# Altium schematic sheet Receiver.SchDoc
size Letter
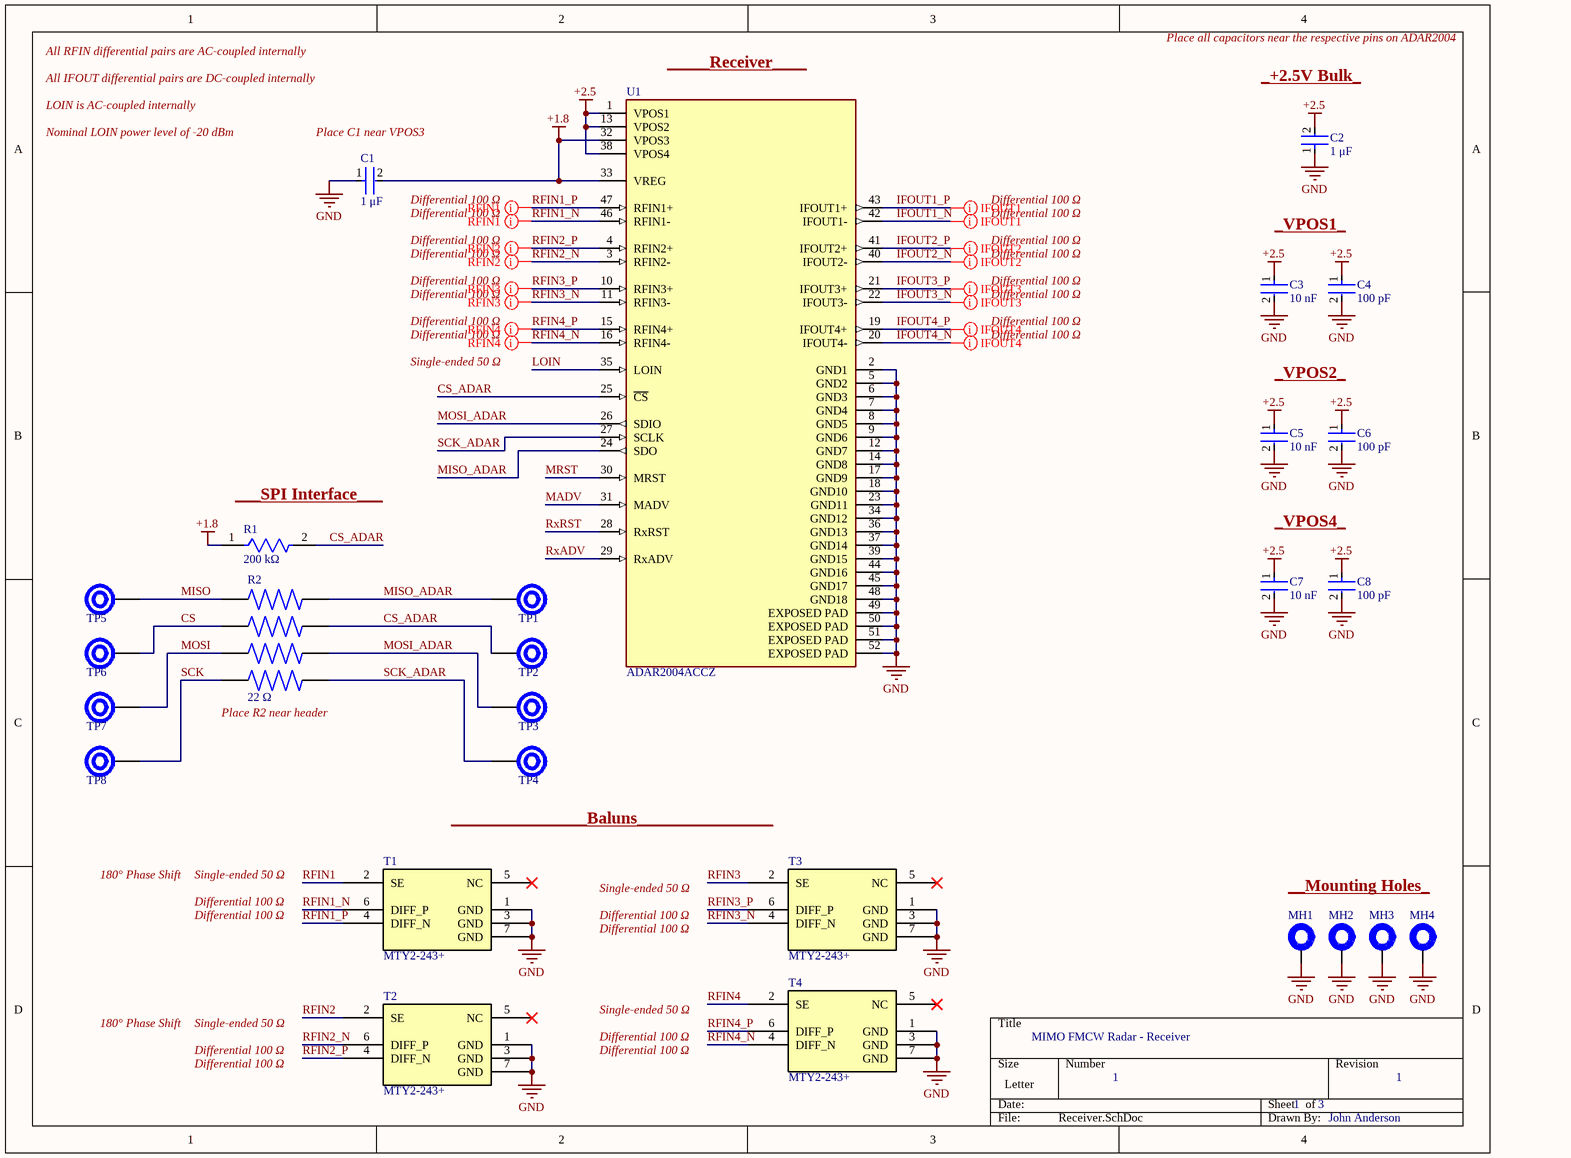
[diagram p0: Receiver.SchDoc]

## Parts
C1  1 μF  [FP-0603-L_1_6_0_15-W_0_8-MFG]
C2  1 μF  [FP-0603-L_1_6_0_15-W_0_8-MFG]
C3  10 nF  [CGA3E2X7R1H103K080AA-Footprint-1]
C4  100 pF  [FP-C0603C-CF-IPC_C]
C5  10 nF  [CGA3E2X7R1H103K080AA-Footprint-1]
C6  100 pF  [FP-C0603C-CF-IPC_C]
C7  10 nF  [CGA3E2X7R1H103K080AA-Footprint-1]
C8  100 pF  [FP-C0603C-CF-IPC_C]
MH1  M3 Plated Mounting Hole - Loose  [M3 Plated Mounting Hole-Footprint-1]  (value not drawn)
MH2  M3 Plated Mounting Hole - Loose  [M3 Plated Mounting Hole-Footprint-1]  (value not drawn)
MH3  M3 Plated Mounting Hole - Loose  [M3 Plated Mounting Hole-Footprint-1]  (value not drawn)
MH4  M3 Plated Mounting Hole - Loose  [M3 Plated Mounting Hole-Footprint-1]  (value not drawn)
R1  200 kΩ  [FP-RG1608-IPC_C]
R2  22 Ω  [CAY16-22R0F4LF-Footprint-1]
T1  MTY2-243+  [MTY2-243+-Footprint-1]
T2  MTY2-243+  [MTY2-243+-Footprint-1]
T3  MTY2-243+  [MTY2-243+-Footprint-1]
T4  MTY2-243+  [MTY2-243+-Footprint-1]
TP1  Test Point - 32 mil  [Test Point - 32 mil-Footprint-1]  (value not drawn)
TP2  Test Point - 32 mil  [Test Point - 32 mil-Footprint-1]  (value not drawn)
TP3  Test Point - 32 mil  [Test Point - 32 mil-Footprint-1]  (value not drawn)
TP4  Test Point - 32 mil  [Test Point - 32 mil-Footprint-1]  (value not drawn)
TP5  Test Point - 32 mil  [Test Point - 32 mil-Footprint-1]  (value not drawn)
TP6  Test Point - 32 mil  [Test Point - 32 mil-Footprint-1]  (value not drawn)
TP7  Test Point - 32 mil  [Test Point - 32 mil-Footprint-1]  (value not drawn)
TP8  Test Point - 32 mil  [Test Point - 32 mil-Footprint-1]  (value not drawn)
U1  ADAR2004ACCZ  [FP-CC-48-2-MFG]

## Nets
+1.8: C1.2 R1.1 U1.32(VPOS3) U1.33(VREG)
+2.5: C2.2 C3.1 C4.1 C5.1 C6.1 C7.1 C8.1 U1.1(VPOS1) U1.13(VPOS2) U1.38(VPOS4)
GND: C1.1 C2.1 C3.2 C4.2 C5.2 C6.2 C7.2 C8.2 MH1.1 MH2.1 MH3.1 MH4.1 T1.1(GND) T1.3(GND) T1.7(GND) T2.1(GND) T2.3(GND) T2.7(GND) T3.1(GND) T3.3(GND) T3.7(GND) T4.1(GND) T4.3(GND) T4.7(GND) U1.2(GND1) U1.5(GND2) U1.6(GND3) U1.7(GND4) U1.8(GND5) U1.9(GND6) U1.12(GND7) U1.14(GND8) U1.17(GND9) U1.18(GND10) U1.23(GND11) U1.34(GND12) U1.36(GND13) U1.37(GND14) U1.39(GND15) U1.44(GND16) U1.45(GND17) U1.48(GND18) U1.49(EXPOSED_PAD) U1.50(EXPOSED_PAD) U1.51(EXPOSED_PAD) U1.52(EXPOSED_PAD)
CS: R2.2 TP6.1
CS_ADAR: R1.2 R2.7 TP2.1 U1.25(~{CS})
IFOUT1_N: U1.42(IFOUT1-)
IFOUT1_P: U1.43(IFOUT1+)
IFOUT2_N: U1.40(IFOUT2-)
IFOUT2_P: U1.41(IFOUT2+)
IFOUT3_N: U1.22(IFOUT3-)
IFOUT3_P: U1.21(IFOUT3+)
IFOUT4_N: U1.20(IFOUT4-)
IFOUT4_P: U1.19(IFOUT4+)
LOIN: U1.35(LOIN)
MADV: U1.31(MADV)
MISO: R2.1 TP5.1
MISO_ADAR: R2.8 TP1.1 U1.24(SDO)
MOSI: R2.3 TP7.1
MOSI_ADAR: R2.6 TP3.1 U1.26(SDIO)
MRST: U1.30(MRST)
RFIN1: T1.2(SE)
RFIN1_N: T1.6(DIFF_P) U1.46(RFIN1-)
RFIN1_P: T1.4(DIFF_N) U1.47(RFIN1+)
RFIN2: T2.2(SE)
RFIN2_N: T2.6(DIFF_P) U1.3(RFIN2-)
RFIN2_P: T2.4(DIFF_N) U1.4(RFIN2+)
RFIN3: T3.2(SE)
RFIN3_N: T3.4(DIFF_N) U1.11(RFIN3-)
RFIN3_P: T3.6(DIFF_P) U1.10(RFIN3+)
RFIN4: T4.2(SE)
RFIN4_N: T4.4(DIFF_N) U1.16(RFIN4-)
RFIN4_P: T4.6(DIFF_P) U1.15(RFIN4+)
RxADV: U1.29(RxADV)
RxRST: U1.28(RxRST)
SCK: R2.4 TP8.1
SCK_ADAR: R2.5 TP4.1 U1.27(SCLK)

Not connected (* = marked no-connect by the designer): T1 5(NC)*; T2 5(NC)*; T3 5(NC)*; T4 5(NC)*

## Layout directives
differential pair: IFOUT1_N, IFOUT1_P, IFOUT2_N, IFOUT2_P, IFOUT3_N, IFOUT3_P, IFOUT4_N, IFOUT4_P, RFIN1_N, RFIN1_P, RFIN2_N, RFIN2_P, RFIN3_N, RFIN3_P, RFIN4_N, RFIN4_P

## Notes on the sheet
- All RFIN differential pairs are AC-coupled internally
- All IFOUT differential pairs are DC-coupled internally
- (near U1) _____Receiver____
- Place all capacitors near the respective pins on ADAR2004
- (near C2) _+2.5V Bulk_
- Nominal LOIN power level of -20 dBm
- LOIN is AC-coupled internally
- (near C1) Place C1 near VPOS3
- (near C1) Differential 100 Ω
- Differential 100 Ω
- _VPOS1_
- Single-ended 50 Ω
- _VPOS2_
- (near R1) ___SPI Interface___
- _VPOS4_
- (near R2) Place R2 near header
- ________________Baluns________________
- 180° Phase Shift
- __Mounting Holes_
- MIMO FMCW Radar - Receiver
- 1
- 3
- John Anderson

## Library data of the parts
C1 C2 = CMP-00100-1: Ceramic Capacitor, Multilayer, Ceramic, 50V, 10% +Tol, 10% -Tol, X7R, 15% TC, 1uF, Surface Mount, 0603; Multilayer: Yes; Packaging: Tape and Reel; Dielectric Material: Ceramic; Terminal Finish: Tin; Min Operating Temperature: -55°C; Mounting Technology: Surface Mount; Pins: 2; Rated DC Voltage (URdc): 50V; Tolerance (fill in as +-): 10%; Package Style: SMTMeter; Length: 1.6mm; RoHS Compliant: Yes; Temperature Characteristics Code: X7R; Value: 1uF; Tolerance  (fill in as +-): 10%; Max Operating Temperature: 125°C; JESD-609 Code: e3; Package Shape: Rectangular; Termination: Wraparound; Reach SVHC Compliant: Yes; Case/Package: 0603; Width: 0.8mm; Capacitor Type: Ceramic; Height: 0.8mm
C3 C5 C7 = CMP-00157-1: CGA Series 0603 10 nF 50 V ±10 % Tolerance X7R SMT Multilayer Ceramic Capacitor; Manufacturer Lifecycle Status: PRODUCTION; Voltage Rating: 50V; Value: 10nF; Tolerance: 10%; Weight: 2.012816mg; Min Width: 700µm; Lead Free: Lead Free; Voltage Rating (DC): 50V; Max Length: 1.7mm; Width: 800µm; Schedule B: 8532240020, 8532240020; Thickness: 889µm; China RoHS: Compliant; Height: 800µm; Material: Ceramic; REACH SVHC: Yes; RoHS: Compliant; Dielectric: X7R; Length: 1.6mm; Ratings: AEC-Q200; Mounting Technology: Surface Mount; Composition: Ceramic; Case/Package: 0603; Termination: SMD/SMT; Dielectric Material: Ceramic; Lifecycle Status: Production; Min Operating Temperature: -55°C; Max Operating Temperature: 125°C; Number of Terminals: 2; Case Code (Metric): 1608; Case Code (Imperial): 0603; Max Width: 900µm; Min Length: 1.5mm
C4 C6 C8 = CMP-00365-1: Multilayer Ceramic Capacitors MLCC – SMD/SMT; KEMET; C0603C101J5GACTU; 100 pF; 0603; 50 V; 50 V; Voltage: 50V; Tolerance: 5%; Dielectric: C0G; Temperature Coefficient: 30ppm/°C; Dissipation Factor: 0.1%; Value: 100pF; Contact Material: Tin; Schedule B: 8532240020, 8532240020; Termination: SMD/SMT; Packaging: Cut Tape; Country of Origin: Mainland China, Mexico; RoHS: Compliant; Height: 800µm; Voltage Rating (AC): 50V; Material: Ceramic; Lifecycle Status: Production; Number of Terminals: 2; Voltage Rating: 50V; Case/Package: 0603; Mounting Technology: Surface Mount; Length: 1.6mm; Min Operating Temperature: -55°C; Width: 800µm; Introduction Date: 1997-02-01; Lead Pitch: 700µm; China RoHS: Compliant; Depth: 800µm; Harmonized Tariff Schedule (HTS) Code: 8532.24.00.20; REACH SVHC: Yes; Dielectric Material: Ceramic; Lead Free: Lead Free; Case Code (Imperial): 0603; Radiation Hardening: No; Voltage Rating (DC): 50V; Export Control Classification Number (ECCN) Code: EAR99; Max Operating Temperature: 125°C; Thickness: 863.6µm; Pins: 2
MH1-MH4 = CMP-00204-1: Plated M3 mounting hole with loose tolerance. 3.6 mm hole diameter, 4.6 mm plated diameter.
R1 = CMP-00366-1: Res Thin Film 0603 200K Ohm 0.1% 0.1W(1/10W) ±25ppm/C Sulfur Resistant Pad SMD Automotive T/R; Voltage Rating (DC): 75V; Working Voltage: 100V; Temperature Coefficient: 25ppm/°C; Max Power Dissipation: 100mW; Value: 200kΩ; Number of Terminals: 2; Height: 400µm; Composition: Thin Film; RoHS: Compliant; Number of Terminations: 2; Lifecycle Status: Production; REACH SVHC: Yes; Termination: SMD/SMT; Tolerance: 0.1%; Weight: 2.012816mg; Case Code (Metric): 1608; Power Dissipation: 100mW; Max Operating Temperature: 155°C; Voltage Rating: 100V; Export Control Classification Number (ECCN) Code: EAR99; Min Operating Temperature: -55°C; Harmonized Tariff Schedule (HTS) Code: 8533.21.00.30; Mounting Technology: Surface Mount; Lead Free: Lead Free; Case Code (Imperial): 0603; Schedule B: 8533210045; Length: 1.6mm; Width: 800µm; Power Rating: 100mW; Introduction Date: 2006-03-30; Features: Automotive AEC-Q200; Case/Package: 0603; Country of Origin: Mainland China, Japan
R2 = CMP-00370-1: Res Thick Film Array 22 Ohm 1% 0.25W(1/4W) ±200ppm/C ISOL 8-Pin 1206(4 X 0603) Convex SMD T/R; Temperature Coefficient: 200ppm/°C; Power Per Element: 62.5mW; Number of Elements: 1; Power Dissipation: 250mW; Number of Resistors: 4; Voltage Rating (DC): 50V; Value: 22Ω; Circuit Type: Isolated; REACH SVHC: Yes; Depth: 1.6mm; Case/Package: 1206; Case Code (Imperial): 1206; Lead Pitch: 800µm; Width: 1.6mm; China RoHS: Non-Compliant; Pins: 8; Introduction Date: 2003-04-07; Case Code (Metric): 3216; Schedule B: 8533210025, 8533210025; Mounting Technology: Surface Mount; Termination: Convex; Export Control Classification Number (ECCN) Code: EAR99; Min Operating Temperature: -55°C; Military Standard: Not; Tolerance: 1%; Height: 500µm; Number of Circuits: 4; Lifecycle Status: Production; Working Voltage: 50V; RoHS: Compliant; Max Operating Temperature: 125°C; Contact Plating: Tin; Number of Terminals: 8; Length: 3.2mm; Terminal Pitch: 800µm
T1-T4 = CMP-00368-1: RF Transformer, 10000MHz Min, 24000MHz Max; Insertion Loss (dB): 2.2dB; Clock Frequency: 24GHz; Height: 1mm; Max Operating Temperature: 85°C; Mounting Technology: Surface Mount; Export Control Classification Number (ECCN) Code: EAR99; RoHS: Compliant; Width: 2mm; Length: 2mm; Lifecycle Status: Production; Min Operating Temperature: -40°C; Introduction Date: 2019-12-24
TP1-TP8 = CMP-00284-1: 32 mil (0.8 mm) test point.
U1 = CMP-00363-1: 10 GHz to 40 GHz, 4-Channel Rx Mixer with 4× LO Multiplier/Filter; Manufacturer Lifecycle Status: PRODUCTION; Clock Frequency: 40GHz; Min Supply Voltage: 1.6V; Noise Figure: 11dB; Bandwidth: 800MHz; Gain: 21dB; Max Junction Temperature (Tj): 135°C; Max Supply Voltage: 2.75V; Min Operating Temperature: -40°C; Lifecycle Status: Production; Max Operating Temperature: 85°C; Pins: 48; Schedule B: 8542390000, 8542390000; Height: 780µm; RoHS: Compliant